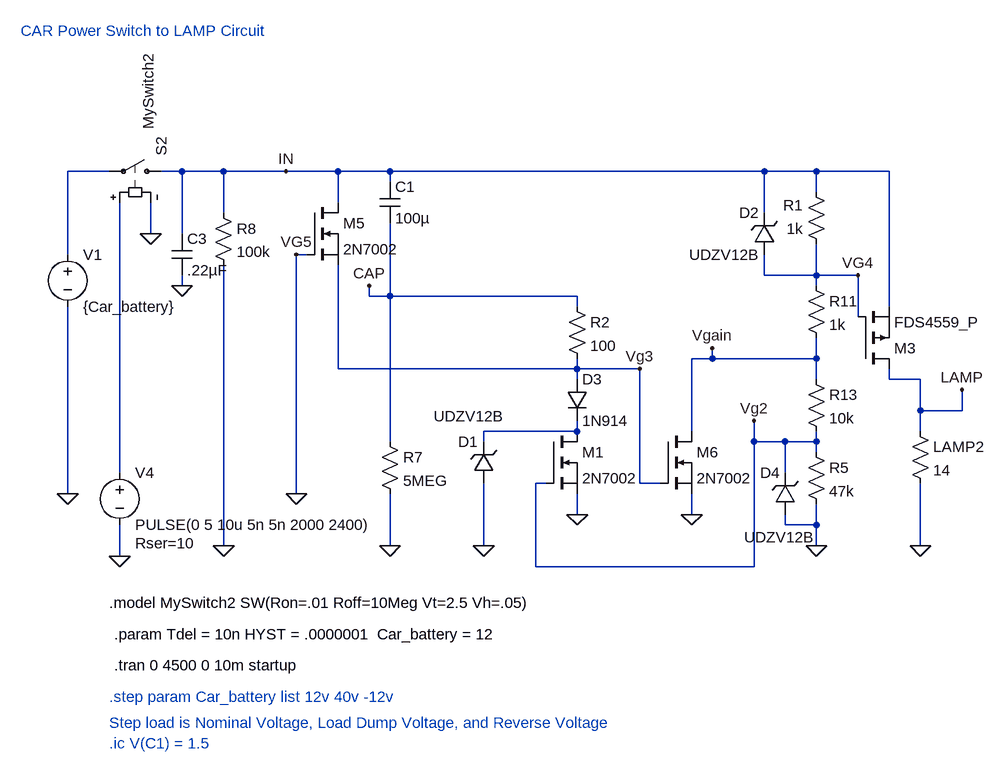
[diagram p0: schematic Analog15TimerForBMWTrunkLight.asc]
Analog15TimerForBMWTrunkLight.asc, the LTspice schematic file:
Version 4
SHEET 1 3100 768
WIRE 1408 -208 1344 -208
WIRE 1520 -208 1488 -208
WIRE 1584 -208 1520 -208
WIRE 1680 -208 1584 -208
WIRE 1760 -208 1680 -208
WIRE 1840 -208 1760 -208
WIRE 2416 -208 1840 -208
WIRE 2496 -208 2416 -208
WIRE 2608 -208 2496 -208
WIRE 1840 -192 1840 -208
WIRE 2496 -176 2496 -208
WIRE 1760 -160 1760 -208
WIRE 1584 -144 1584 -208
WIRE 2416 -144 2416 -208
WIRE 1472 -112 1472 -160
WIRE 1520 -112 1520 -208
WIRE 1344 -80 1344 -208
WIRE 1712 -80 1696 -80
WIRE 2416 -48 2416 -80
WIRE 2496 -48 2496 -96
WIRE 2496 -48 2416 -48
WIRE 2560 -48 2496 -48
WIRE 1520 -32 1520 -48
WIRE 2496 -32 2496 -48
WIRE 1808 -16 1808 -32
WIRE 1840 -16 1840 -128
WIRE 1840 -16 1808 -16
WIRE 2128 -16 1840 -16
WIRE 2128 0 2128 -16
WIRE 2608 0 2608 -208
WIRE 2560 16 2560 -48
WIRE 2336 80 2336 64
WIRE 2336 80 2304 80
WIRE 2496 80 2496 48
WIRE 2496 80 2336 80
WIRE 1760 96 1760 -64
WIRE 2128 96 2128 80
WIRE 2128 96 1760 96
WIRE 2224 96 2128 96
WIRE 2128 112 2128 96
WIRE 2496 112 2496 80
WIRE 2608 112 2608 96
WIRE 2656 112 2608 112
WIRE 2656 160 2656 112
WIRE 2720 160 2720 128
WIRE 2720 160 2656 160
WIRE 2128 192 2128 176
WIRE 2128 192 1984 192
WIRE 2304 192 2304 80
WIRE 2656 192 2656 160
WIRE 1840 208 1840 -16
WIRE 1984 208 1984 192
WIRE 2400 208 2400 176
WIRE 2448 208 2400 208
WIRE 2496 208 2496 192
WIRE 2496 208 2448 208
WIRE 2496 224 2496 208
WIRE 1424 256 1424 -160
WIRE 2448 256 2448 208
WIRE 2080 272 2064 272
WIRE 2224 272 2224 96
WIRE 2256 272 2224 272
WIRE 1344 288 1344 0
WIRE 1696 288 1696 -80
WIRE 2128 320 2128 288
WIRE 2304 320 2304 288
WIRE 2448 336 2448 320
WIRE 2496 336 2496 304
WIRE 2496 336 2448 336
WIRE 1584 368 1584 -64
WIRE 1840 368 1840 288
WIRE 1984 368 1984 272
WIRE 2496 368 2496 336
WIRE 2656 368 2656 272
WIRE 1424 384 1424 336
WIRE 2064 400 2064 272
WIRE 2400 400 2400 208
WIRE 2400 400 2064 400
FLAG 1840 368 0
FLAG 1344 288 0
FLAG 1584 368 0
FLAG 1472 -112 0
FLAG 1424 384 0
FLAG 2656 368 0
FLAG 1696 288 0
FLAG 2720 128 LAMP
FLAG 1808 -32 CAP
FLAG 1520 -32 0
FLAG 2304 320 0
FLAG 2496 368 0
FLAG 2128 320 0
FLAG 2400 176 Vg2
FLAG 2336 64 Vgain
FLAG 1680 -208 IN
FLAG 1984 368 0
FLAG 2224 96 Vg3
FLAG 2560 -48 VG4
FLAG 1696 -80 VG5
SYMBOL res 2480 208 R0
SYMATTR InstName R5
SYMATTR Value 47k
SYMBOL res 1824 192 R0
SYMATTR InstName R7
SYMATTR Value 5MEG
SYMBOL cap 1824 -192 R0
SYMATTR InstName C1
SYMATTR Value 100µ
SYMBOL voltage 1344 -96 R0
WINDOW 123 0 0 Left 2
WINDOW 39 0 0 Left 2
SYMATTR InstName V1
SYMATTR Value {Car_battery}
SYMBOL voltage 1424 240 R0
WINDOW 123 0 0 Left 2
WINDOW 39 24 124 Left 2
SYMATTR SpiceLine Rser=10
SYMATTR InstName V4
SYMATTR Value PULSE(0 5 10u 5n 5n 2000 2400)
SYMBOL res 1568 -160 R0
SYMATTR InstName R8
SYMATTR Value 100k
SYMBOL sw 1504 -208 M270
WINDOW 3 65 36 Left 2
SYMATTR Value MySwitch2
SYMATTR InstName S2
SYMBOL pmos 2560 96 M180
SYMATTR InstName M3
SYMATTR Value FDS4559_P
SYMBOL res 2640 176 R0
SYMATTR InstName LAMP2
SYMATTR Value 14
SYMBOL nmos 1712 -160 R0
SYMATTR InstName M5
SYMATTR Value 2N7002
SYMBOL zener 2464 320 R180
WINDOW 0 24 64 Left 2
WINDOW 3 -29 -35 Left 2
SYMATTR InstName D4
SYMATTR Value UDZV12B
SYMATTR Description Diode
SYMATTR Type diode
SYMBOL cap 1504 -112 R0
SYMATTR InstName C3
SYMATTR Value .22µF
SYMBOL res 2480 -48 R0
SYMATTR InstName R11
SYMATTR Value 1k
SYMBOL nmos 2256 192 R0
SYMATTR InstName M6
SYMATTR Value 2N7002
SYMBOL res 2480 96 R0
SYMATTR InstName R13
SYMATTR Value 10k
SYMBOL nmos 2080 192 R0
SYMATTR InstName M1
SYMATTR Value 2N7002
SYMBOL zener 2000 272 R180
WINDOW 0 24 64 Left 2
WINDOW 3 -15 103 Left 2
SYMATTR InstName D1
SYMATTR Value UDZV12B
SYMATTR Description Diode
SYMATTR Type diode
SYMBOL res 2512 -80 R180
WINDOW 0 36 76 Left 2
WINDOW 3 36 40 Left 2
SYMATTR InstName R1
SYMATTR Value 1k
SYMBOL zener 2432 -80 R180
WINDOW 0 24 64 Left 2
WINDOW 3 24 0 Left 2
SYMATTR InstName D2
SYMATTR Value UDZV12B
SYMATTR Description Diode
SYMATTR Type diode
SYMBOL diode 2112 112 R0
SYMATTR InstName D3
SYMATTR Value 1N914
SYMBOL res 2112 -16 R0
SYMATTR InstName R2
SYMATTR Value 100
TEXT 1416 504 Left 2 !.param Tdel = 10n HYST = .0000001  Car_battery = 12
TEXT 1408 456 Left 2 !.model MySwitch2 SW(Ron=.01 Roff=10Meg Vt=2.5 Vh=.05)
TEXT 1416 552 Left 2 !.tran 0 4500 0 10m startup
TEXT 1408 600 Left 2 ;.step param Car_battery list 12v 40v -12v
TEXT 1408 640 Left 2 ;Step load is Nominal Voltage, Load Dump Voltage, and Reverse Voltage
TEXT 1408 672 Left 2 ;.ic V(C1) = 1.5
TEXT 1272 -424 Left 2 ;CAR Power Switch to LAMP Circuit

The netlist it stands for:
* Analog15TimerForBMWTrunkLight.asc
R5 Vg2 0 47k
R7 CAP 0 5MEG
C1 IN CAP 100µ
V1 N001 0 {Car_battery}
V4 N003 0 PULSE(0 5 10u 5n 5n 2000 2400) Rser=10
R8 IN 0 100k
S2 IN N001 N003 0 MySwitch2
M3 LAMP VG4 IN IN FDS4559_P
R§LAMP2 LAMP 0 14
M5 IN 0 Vg3 Vg3 2N7002
D4 0 Vg2 UDZV12B
C3 IN 0 .22µF
R11 VG4 Vgain 1k
M6 Vgain Vg3 0 0 2N7002
R13 Vgain Vg2 10k
M1 N002 Vg2 0 0 2N7002
D1 0 N002 UDZV12B
R1 VG4 IN 1k
D2 VG4 IN UDZV12B
D3 Vg3 N002 1N914
R2 CAP Vg3 100
.model D D
.lib standard.dio
.model NMOS NMOS
.model PMOS PMOS
.lib standard.mos
.param Tdel = 10n HYST = .0000001  Car_battery = 12
.model MySwitch2 SW(Ron=.01 Roff=10Meg Vt=2.5 Vh=.05)
.tran 0 4500 0 10m startup
* .step param Car_battery list 12v 40v -12v
* Step load is Nominal Voltage, Load Dump Voltage, and Reverse Voltage
* .ic V(C1) = 1.5
* CAR Power Switch to LAMP Circuit
.backanno
.end